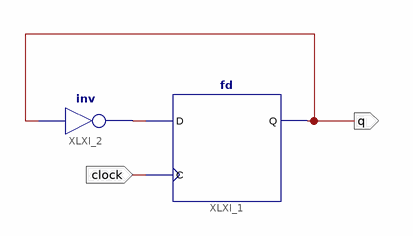
[diagram p0: schematic sheet 1]
// Xilinx ISE schematic dffnew.sch (artix7) as structural Verilog: 2 symbols, 2 ports
module dffnew (
  input  clock,
  output q
);

  wire XLXN_2;

  fd XLXI_1 (.C(clock), .D(XLXN_2), .Q(q));
  not XLXI_2 (XLXN_2, q);
endmodule
